# Altium project Service_eval_board.PrjPcb (part 2 of 3)

## Sheet MCU.SchDoc
size A3; DocumentNumber: 5; SheetNumber: 5; SheetTotal: 10
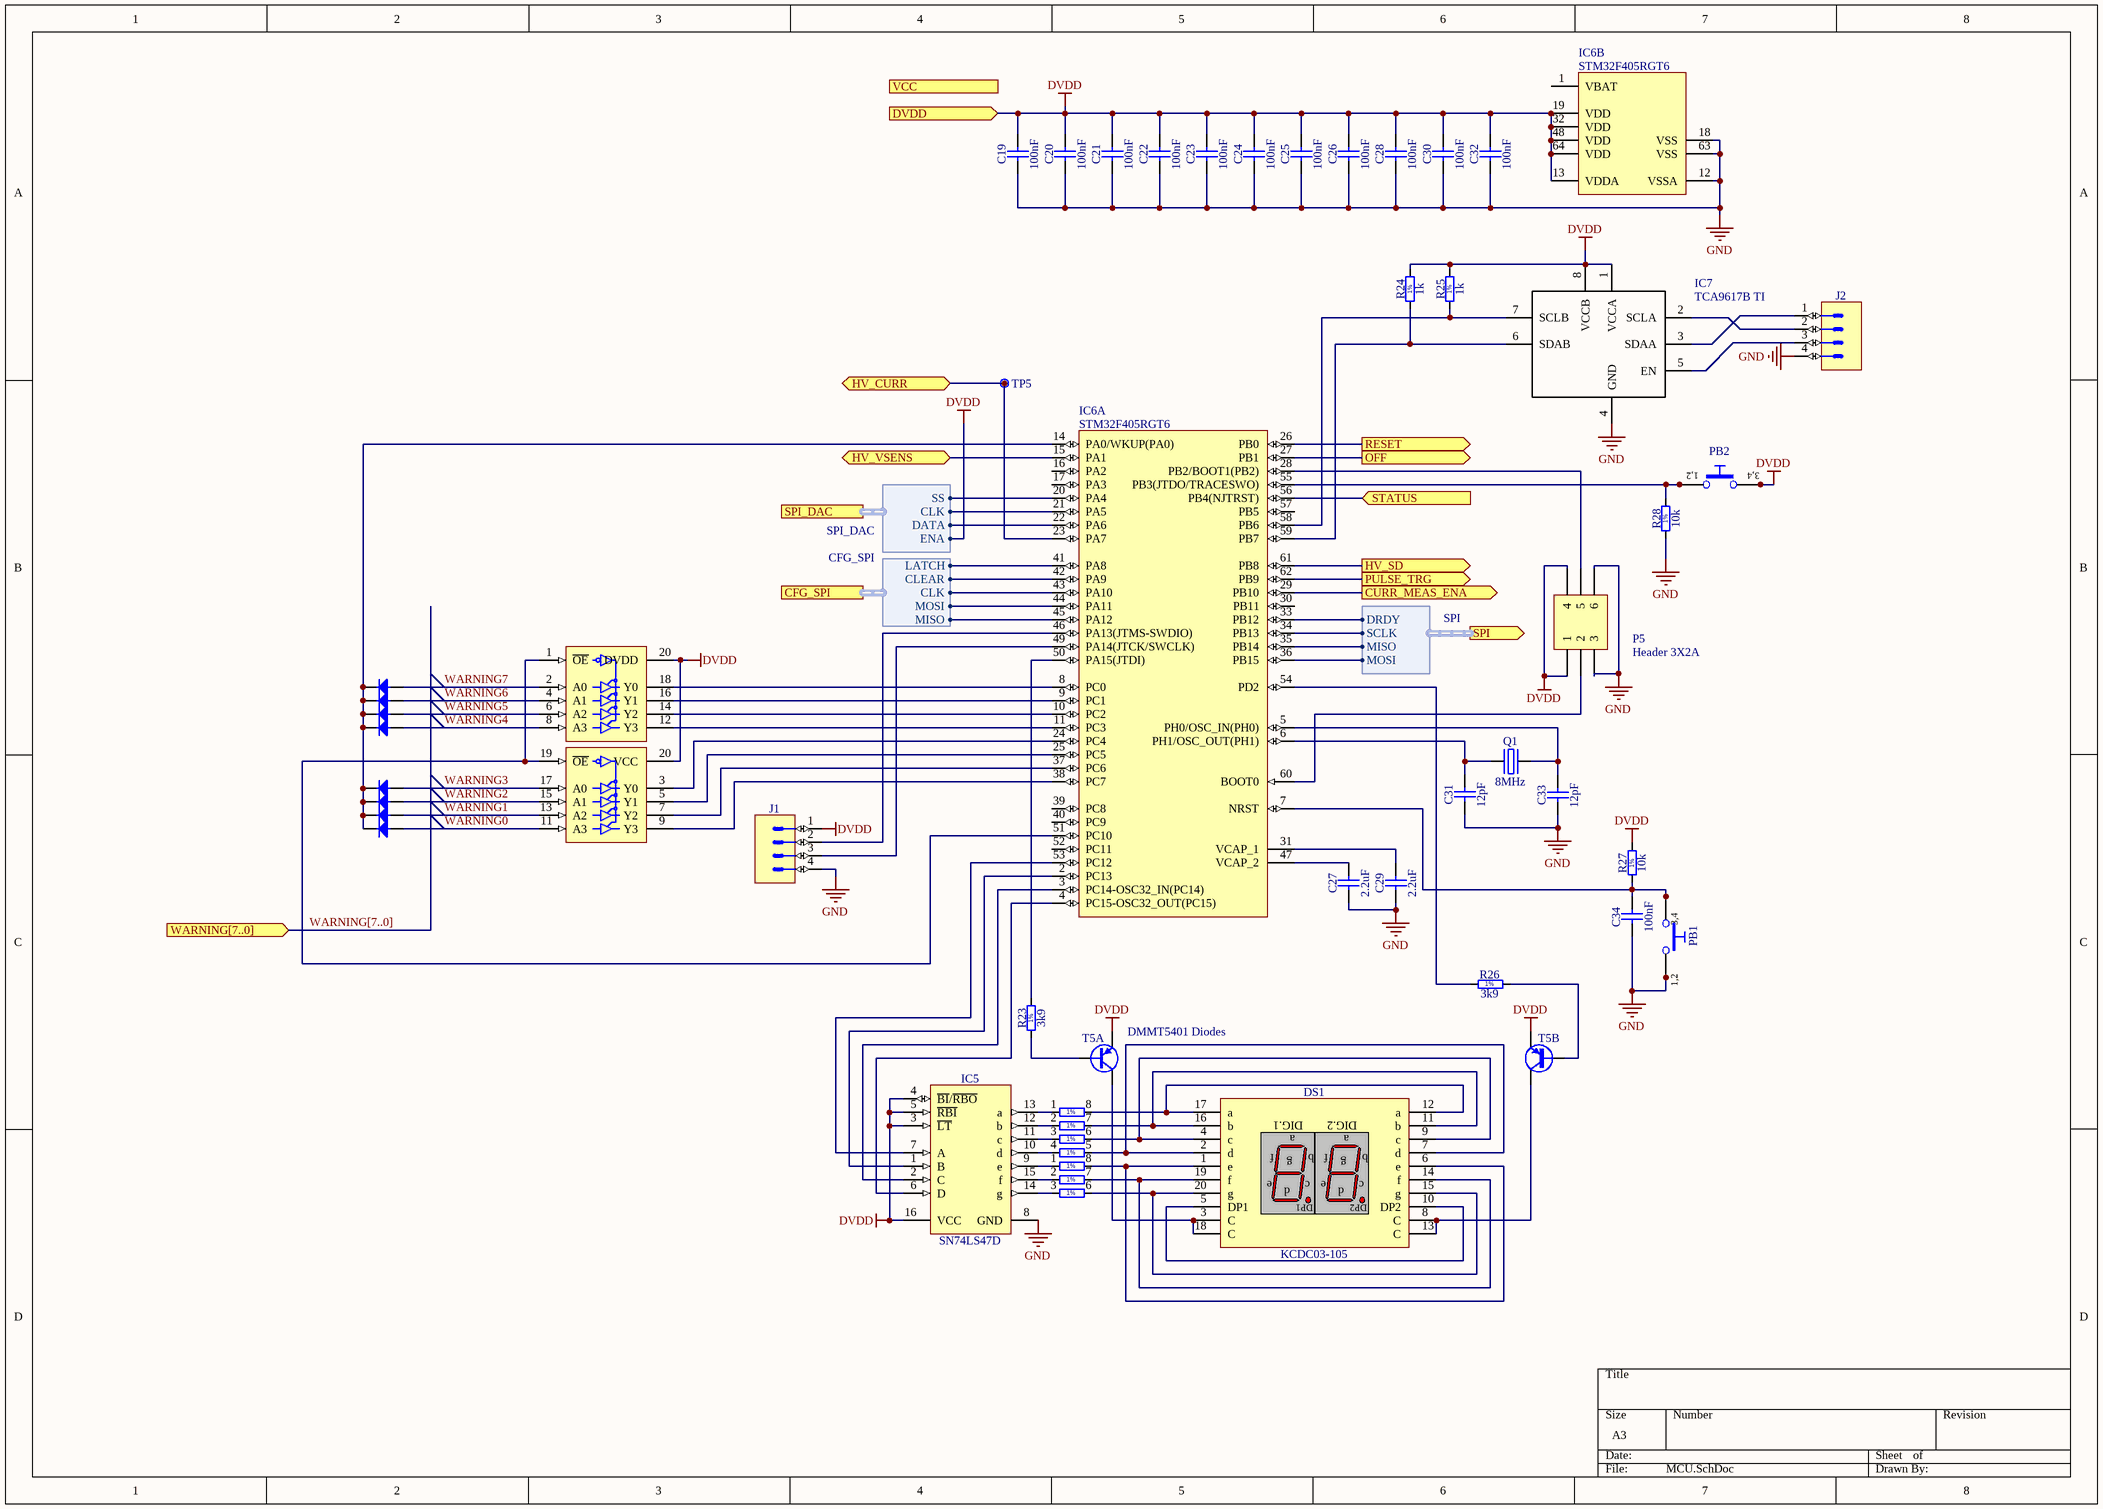
[diagram p3: MCU.SchDoc]

### Parts
C19  100nF  [CAPC2012X135N]
C20  100nF  [CAPC2012X135N]
C21  100nF  [CAPC2012X135N]
C22  100nF  [CAPC2012X135N]
C23  100nF  [CAPC2012X135N]
C24  100nF  [CAPC2012X135N]
C25  100nF  [CAPC2012X135N]
C26  100nF  [CAPC2012X135N]
C27  2.2uF  [CAPC2012X135N]
C28  100nF  [CAPC2012X135N]
C29  2.2uF  [CAPC2012X135N]
C30  100nF  [CAPC2012X135N]
C31  12pF  [CAPC2012X135N]
C32  100nF  [CAPC2012X135N]
C33  12pF  [CAPC2012X135N]
C34  100nF  [CAPC2012X135N]
D3  MCL4148-TR3  [DIOMELF1911N]  (value not drawn)
D4  MCL4148-TR3  [DIOMELF1911N]  (value not drawn)
D5  MCL4148-TR3  [DIOMELF1911N]  (value not drawn)
D6  MCL4148-TR3  [DIOMELF1911N]  (value not drawn)
D7  MCL4148-TR3  [DIOMELF1911N]  (value not drawn)
D8  MCL4148-TR3  [DIOMELF1911N]  (value not drawn)
D9  MCL4148-TR3  [DIOMELF1911N]  (value not drawn)
D10  MCL4148-TR3  [DIOMELF1911N]  (value not drawn)
DS1  KCDC03-105  [DS_KINGBRIGHT_KCDC03-105]
IC4  74HCT244D  [SOIC127P1032X265-20N]  (value not drawn)  (parts A,B of 2)
IC5  SN74LS47D  [SOIC127P600X175-16N]
IC6  STM32F405RGT6  [QFP50P1200X1200X160-64N]  (parts A,B of 2)
IC7  TCA9617B TI  [TSOP65P490X110-8N]
J1  Header 4  [PRECI-DIP_350-V3-104-00-001101]  (value not drawn)
J2  Header 4  [PRECI-DIP_350-V3-104-00-001101]  (value not drawn)
P5  Header 3X2A  [HDR2X3_CEN]
PB1  Push Button  [PB_OMRON_B3F-1000]  (value not drawn)
PB2  Push Button  [PB_OMRON_B3F-1000]  (value not drawn)
Q1  8MHz  [XTAL_TXC_7A]
R23  3k9  [RESC2012X60N]
R24  1k  [RESC2012X60N]
R25  1k  [RESC2012X60N]
R26  3k9  [RESC2012X60N]
R27  10k  [RESC2012X60N]
R28  10k  [RESC2012X60N]
RN1  220  [RN_VISHAY_CRA12E08]  (value not drawn)  (parts A,B,C,D of 4)
RN2  220  [RN_VISHAY_CRA12E08]  (value not drawn)  (parts A,B,C of 4)
T5  DMMT5401 Diodes  [SOT95P280X145-6N]  (parts A,B of 2)
TP5  Test Point  [VERO_20-2136]  (value not drawn)

### Ports
CFG_SPI (harness CFG_SPI), CURR_MEAS_ENA (out), DVDD (in), HV_CURR (bidir), HV_SD (out), HV_VSENS (bidir), OFF (out), PULSE_TRG (out), RESET (out), SPI (out, harness SPI), SPI_DAC (harness SPI_DAC), STATUS (in), VCC (in), WARNING[7..0] (in)

### Harnesses
SPI_DAC: SS, CLK, DATA, ENA
SPI: DRDY, MISO, SCLK, MOSI
CFG_SPI: LATCH, CLEAR, CLK, MOSI, MISO

### Nets
DVDD: C19.2 C20.2 C21.2 C22.2 C23.2 C24.2 C25.2 C26.2 C28.2 C30.2 C32.2 IC4.20(DVDD) IC5.3(~{LT}) IC5.4(~{BI}/~{RBO}) IC5.5(~{RBI}) IC5.16(VCC) IC6.13(VDDA) IC6.19(VDD) IC6.32(VDD) IC6.48(VDD) IC6.64(VDD) IC7.1(VCCA) IC7.8(VCCB) J1.1 P5.1 P5.4 PB2.3 PB2.4 R24.2 R25.2 R27.2 T5.5(E) T5.6(E) ; port DVDD, port SPI_DAC.ENA
GND: C19.1 C20.1 C21.1 C22.1 C23.1 C24.1 C25.1 C26.1 C27.1 C28.1 C29.1 C30.1 C31.1 C32.1 C33.1 C34.1 IC4.10(GND) IC5.8(GND) IC6.12(VSSA) IC6.18(VSS) IC6.63(VSS) IC7.4(GND) J1.4 J2.4 P5.3 P5.6 PB1.1 PB1.2 R28.1
WARNING0: D10.2(A) IC4.11(A3)  [project net W_B0]
WARNING1: D9.2(A) IC4.13(A2)  [project net W_B1]
WARNING2: D8.2(A) IC4.15(A1)  [project net W_B2]
WARNING3: D7.2(A) IC4.17(A0)  [project net W_B3]
WARNING4: D6.2(A) IC4.8(A3)  [project net W_A0]
WARNING5: D5.2(A) IC4.6(A2)  [project net W_A1]
WARNING6: D4.2(A) IC4.4(A1)  [project net W_A2]
WARNING7: D3.2(A) IC4.2(A0)  [project net W_A3]
NetC27_2: C27.2 IC6.47(VCAP_2)
NetC29_2: C29.2 IC6.31(VCAP_1)
NetC31_2: C31.2 IC6.6(PH1/OSC_OUT(PH1)) Q1.1(OSC1)
NetC33_2: C33.2 IC6.5(PH0/OSC_IN(PH0)) Q1.2(OSC2)
NetC34_2: C34.2 IC6.7(NRST) PB1.3 PB1.4 R27.1
NetD3_1: D3.1(C) D4.1(C) D5.1(C) D6.1(C) D7.1(C) D8.1(C) D9.1(C) D10.1(C) IC6.14(PA0/WKUP(PA0))
NetD12_1: IC6.15(PA1) ; port HV_VSENS
NetDS1_1: DS1.1(e) DS1.6(e) RN2.8
NetDS1_2: DS1.2(d) DS1.7(d) RN1.5
NetDS1_3: DS1.3(C) DS1.18(C) T5.1(C)
NetDS1_4: DS1.4(c) DS1.9(c) RN1.6
NetDS1_5: DS1.5(DP1) DS1.10(DP2)
NetDS1_8: DS1.8(C) DS1.13(C) T5.4(C)
NetDS1_11: DS1.11(b) DS1.16(b) RN1.7
NetDS1_12: DS1.12(a) DS1.17(a) RN1.8
NetDS1_14: DS1.14(f) DS1.19(f) RN2.7
NetDS1_15: DS1.15(g) DS1.20(g) RN2.6
NetIC1_9: IC6.45(PA12) ; port CFG_SPI.MISO
NetIC1_10: IC6.42(PA9) ; port CFG_SPI.CLEAR
NetIC1_11: IC6.43(PA10) ; port CFG_SPI.CLK
NetIC1_12: IC6.41(PA8) ; port CFG_SPI.LATCH
NetIC1_14: IC6.44(PA11) ; port CFG_SPI.MOSI
NetIC2_1_2: IC6.27(PB1) ; port OFF
NetIC2_1_4: IC6.26(PB0) ; port RESET
NetIC2_1_6: IC6.29(PB10) ; port CURR_MEAS_ENA
NetIC4_1: IC4.1(~{OE}) IC4.19(~{OE}) IC6.51(PC10)
NetIC4_3: IC4.3(Y0) IC6.24(PC4)
NetIC4_5: IC4.5(Y1) IC6.25(PC5)
NetIC4_7: IC4.7(Y2) IC6.37(PC6)
NetIC4_9: IC4.9(Y3) IC6.38(PC7)
NetIC4_12: IC4.12(Y3) IC6.11(PC3)
NetIC4_14: IC4.14(Y2) IC6.10(PC2)
NetIC4_16: IC4.16(Y1) IC6.9(PC1)
NetIC4_18: IC4.18(Y0) IC6.8(PC0)
NetIC5_1: IC5.1(B) IC6.2(PC13)
NetIC5_2: IC5.2(C) IC6.3(PC14-OSC32_IN(PC14))
NetIC5_6: IC5.6(D) IC6.4(PC15-OSC32_OUT(PC15))
NetIC5_7: IC5.7(A) IC6.53(PC12)
NetIC5_9: IC5.9(e) RN2.1
NetIC5_10: IC5.10(d) RN1.4
NetIC5_11: IC5.11(c) RN1.3
NetIC5_12: IC5.12(b) RN1.2
NetIC5_13: IC5.13(a) RN1.1
NetIC5_14: IC5.14(g) RN2.3
NetIC5_15: IC5.15(f) RN2.2
NetIC6_20: IC6.20(PA4) ; port SPI_DAC.SS
NetIC6_21: IC6.21(PA5) ; port SPI_DAC.CLK
NetIC6_22: IC6.22(PA6) ; port SPI_DAC.DATA
NetIC6_23: IC6.23(PA7) TP5.1 ; port HV_CURR
NetIC6_28: IC6.28(PB2/BOOT1(PB2)) P5.5
NetIC6_33: IC6.33(PB12) ; port SPI.DRDY
NetIC6_34: IC6.34(PB13) ; port SPI.SCLK
NetIC6_35: IC6.35(PB14) ; port SPI.MISO
NetIC6_36: IC6.36(PB15) ; port SPI.MOSI
NetIC6_46: IC6.46(PA13(JTMS-SWDIO)) J1.2
NetIC6_49: IC6.49(PA14(JTCK/SWCLK)) J1.3
NetIC6_50: IC6.50(PA15(JTDI)) R23.2
NetIC6_54: IC6.54(PD2) R26.1
NetIC6_55: IC6.55(PB3(JTDO/TRACESWO)) PB2.1 PB2.2 R28.2
NetIC6_56: IC6.56(PB4(NJTRST)) ; port STATUS
NetIC6_58: IC6.58(PB6) IC7.7(SCLB) R25.1
NetIC6_59: IC6.59(PB7) IC7.6(SDAB) R24.1
NetIC6_60: IC6.60(BOOT0) P5.2
NetIC6_61: IC6.61(PB8) ; port HV_SD
NetIC6_62: IC6.62(PB9) ; port PULSE_TRG
NetIC7_2: IC7.2(SCLA) J2.2
NetIC7_3: IC7.3(SDAA) J2.1
NetIC7_5: IC7.5(EN) J2.3
NetR23_1: R23.1 T5.2(B)
NetR26_2: R26.2 T5.3(B)

Not connected (* = marked no-connect by the designer): IC6 1(VBAT) 16(PA2) 17(PA3) 30(PB11) 39(PC8) 40(PC9) 52(PC11) 57(PB5)

### Buses and harness runs
bus WARNING[7..0] = port WARNING[7..0]

### Notes on the sheet
- (in symbol DS_KINGBRIGHT_KCDC03-105) DIG.1; DIG.2
- (in symbol PB_OMRON_B3F-1000) 3,4; 1,2
- (in symbol R0805_1K_1%_0.125W_100PPM) 1%
- (in symbol R0805_3K9_1%_0.125W_100PPM) 1%
- (in symbol R0805_10K_1%_0.125W_100PPM) 1%
- (in symbol RN_220R_VISHAY_CRA12E083220RF, part A) 1%
- (in symbol RN_220R_VISHAY_CRA12E083220RF, part B) 1%
- (in symbol RN_220R_VISHAY_CRA12E083220RF, part C) 1%
- (in symbol RN_220R_VISHAY_CRA12E083220RF, part D) 1%

### Library data of the parts
C19-C26 C28 C30 C32 C34 = CC0805_100NF_50V_10%_X7R: as C35 on sheet Pulser; Part Number: CC0805_100NF_50V_10%_X7R; Component Kind: Standard; Component Type: Standard; Pin Count: 2; Value: 100nF; Status: Preferred; Manufacturer Part Number: CC0805_100NF_50V_10%_X7R; Case: 0805; Mounted: Yes; Socket: No; SMD: Yes; Sense: No; Manufacturer1 Example: TDK; Manufacturer1 ComponentHeight: 1mm; HelpURL: \\cern.ch\dfs\Applications\Altium\Datasheets\CC0805_X7R_TDK_C.pdf; Author: CERN DEM JLC; CreateDate: 03.12.2007; LatestRevisionDate: 22.04.2015
C27 C29 = CC0805_2.2UF_16V_10%_X7R: Non-polarised capacitor; Part Description: SMD Multilayer Chip Ceramic Capacitor; Manufacturer: GENERIC; Manufacturer1 Part Number: GRM21BF51C225ZA01L; Voltage: 16V; TC: X7R; Tolerance: ±10%; Part Number: CC0805_2.2UF_16V_10%_X7R; Component Kind: Standard; Component Type: Standard; Pin Count: 2; Value: 2.2uF; Status: Preferred; Manufacturer Part Number: CC0805_2.2UF_16V_10%_X7R; Case: 0805; Mounted: Yes; Socket: No; SMD: Yes; Sense: No; Manufacturer1 Example: MURATA; Manufacturer1 ComponentHeight: 1.5mm; HelpURL: \\cern.ch\dfs\Applications\Altium\Datasheets\CC0805_X7R_MURATA_GRM.pdf; Author: CERN DEM JLC; CreateDate: 03.12.2007; LatestRevisionDate: 18.09.2014
C31 C33 = CC0805_12PF_50V_5%_NP0: Non-polarised capacitor; Part Description: SMD Multilayer Chip Ceramic Capacitor; Manufacturer: GENERIC; Manufacturer1 Part Number: 223886115129; Voltage: 50V; TC: C0G/NP0; Tolerance: ±5%; Part Number: CC0805_12PF_50V_5%_NP0; Component Kind: Standard; Component Type: Standard; Pin Count: 2; Value: 12pF; Status: Preferred; Manufacturer Part Number: CC0805_12PF_50V_5%_NP0; Case: 0805; Mounted: Yes; Socket: No; SMD: Yes; Sense: No; Manufacturer1 Example: PHYCOMP; Manufacturer1 ComponentHeight: 1.35mm; HelpURL: \\cern.ch\dfs\Applications\Altium\Datasheets\CC0805_NP0_PHYCOMP.pdf; Author: CERN DEM JLC; CreateDate: 03.12.2007; LatestRevisionDate: 03.12.2007
D3-D10 = MCL4148-TR3: Diode; Part Description: Small Signal Fast Switching Diode; Manufacturer: VISHAY GENERAL SEMICONDUCTOR; Voltage: 75V; Power: 200mA; PressFit: No; Bonding: No; Part Number: MCL4148-TR3; Component Kind: Standard; Component Type: Standard; Device: MCL4148-TR3; PackageDescription: MELF Diode, 2-Leads, Body 1.7x1.15mm, IPC Medium Density; Status: Not recommended; Manufacturer Part Number: MCL4148-TR3; Pin Count: 2; Mounted: Yes; Socket: No; SMD: Yes; Sense: No; ComponentHeight: 1.35mm; HelpURL: \\cern.ch\dfs\Applications\Altium\Datasheets\MCL4148-TR3.pdf; Author: CERN DEM JLC; CreateDate: 10.11.2014; LatestRevisionDate: 10.11.2014
DS1 = DS_KINGBRIGHT_KCDC03-105: Dual Digit, SMD 7-Segment Common Cathode Hyper Red Display; PressFit: No; Bonding: No; Part Number: DS_KINGBRIGHT_KCDC03-105; Component Kind: Standard; Component Type: Standard; Color: Hyper Red; Device: KCDC03-105; PackageDescription: 20-Leads, Body 14.8x12mm, Pitch 1.5mm, Hyper Red SMD Common Cathode Dual 7-SegmentDisplay; Part Description: Dual Digit, SMD 7-Segment Common Cathode Hyper Red Display; Manufacturer: KINGBRIGHT; Manufacturer Part Number: KCDC03-105; Pin Count: 20; Mounted: Yes; Socket: No; SMD: Yes; Sense: No; ComponentHeight: 3.75mm; HelpURL: \\cern.ch\dfs\Applications\Altium\Datasheets\DS_KINGBRIGHT_KCDC03-105.pdf; Author: CERN DEM JLC; CreateDate: 12.05.2014; LatestRevisionDate: 21.10.2016
IC4 = 74HCT244D: Octal Buffer And Line Driver with 3-State Ouputs; Part Description: Octal Buffer/Line Driver with 3-State Outputs; Manufacturer: NXP SEMICONDUCTORS; PressFit: No; Bonding: No; Part Number: 74HCT244D; Component Kind: Standard; Component Type: Standard; Device: 74HCT244D; PackageDescription: SOIC, 1.27mm pitch; 20 pin, 7.50mm W X 12.80mm L X 2.65mm H body, IPC Medium Density; Manufacturer Part Number: 74HCT244D; Pin Count: 20; Case: SOIC20; Mounted: Yes; Socket: No; SMD: Yes; Sense: No; ComponentHeight: 2.65mm; Author: CERN DEM JLC; HelpURL: \\cern.ch\dfs\Applications\Altium\Datasheets\74HCT244D.pdf; CreateDate: 27.08.2013; LatestRevisionDate: 27.08.2013
IC5 = SN74LS47D: BCD-to-Seven-Segment Decoder/Driver; Manufacturer: TEXAS INSTRUMENTS; PressFit: No; Bonding: No; Part Number: SN74LS47D; Component Kind: Standard; Component Type: Standard; Device: SN74LS47D; PackageDescription: SOIC 16, Pitch 1.27mm - Body 4x10mm, IPC Medium Density; Part Description: BCD-to-Seven-Segment Decoder/Driver; Manufacturer Part Number: SN74LS47D; Pin Count: 16; Case: SOIC16; Mounted: Yes; Socket: No; SMD: Yes; Sense: No; ComponentHeight: 1.75mm; Author: CERN DEM JMW; HelpURL: \\cern.ch\dfs\Applications\Altium\Datasheets\SN74LS47D.pdf; CreateDate: 04.10.2012; LatestRevisionDate: 04.10.2012
IC6 = STM32F405RGT6: ARM Cortex-M4 32-bit MCU+FPU, 210DMIPS, 1024kB Flash, 192kB+4kB RAM, 51 I/Os, 64-pin LQFP, Industrial Grade –40 to 85°C; Manufacturer: ST MICROELECTRONICS; PressFit: No; Bonding: No; Part Number: STM32F405RGT6; Component Kind: Standard; Component Type: Standard; Device: STM32F405RGT6; PackageDescription: QFP, 0.50mm pitch, square; 16 pin X 16 pin, 10.00mm X 10.00mm, 1.6mm H, IPC Medium Density; Part Description: ARM Cortex-M4 32-bit MCU+FPU, 210DMIPS, 1024kB Flash, 192kB+4kB RAM, 51 I/Os, 64-pin LQFP, Industrial Grade –40 to 85°C; Manufacturer Part Number: STM32F405RGT6; Pin Count: 64; Case: QFP64; Mounted: Yes; Socket: No; SMD: Yes; Sense: No; ComponentHeight: 1.6mm; HelpURL: \\cern.ch\dfs\Applications\Altium\Datasheets\STM32F405RGT6.pdf; Author: CERN DEM JLC; CreateDate: 20.06.2017; LatestRevisionDate: 20.06.2017
IC7 = TCA9617B: Name: TCA9617B; Manufacturer: TI
J1 J2 = PRECI-DIP_350-V3-104-00-001101: Connector 4 Male; Part Description: Pitch 2.54mm, Single Row, Straight 4 Contacts PCB Header; PressFit: No; Part Number: PRECI-DIP_350-V3-104-00-001101; Component Kind: Standard; Component Type: Standard; Pin Count: 4; Family: Header 4; Mounted: Yes; Socket: No; SMD: No; Sense: No; Status: None; Manufacturer: PRECI-DIP; Manufacturer Part Number: 350-V3-104-00-001101; ComponentHeight: 7.96mm; HelpURL: \\cern.ch\dfs\Applications\Altium\Datasheets\PRECI-DIP_350-V3-104-00-001101.pdf; Author: CERN DEM BC; CreateDate: 18.03.2016; LatestRevisionDate: 18.03.2016
P5 = Header 3X2A: Header, 3-Pin, Dual row; LatestRevisionDate: 17-Jul-2002; LatestRevisionNote: Re-released for DXP Platform.; Publisher: Altium Limited
PB1 PB2 = PB_OMRON_B3F-1000: Push-Button Switch SPDT; Part Description: 24VDC 50mA SPST-NO Tactile Push-Button Switch (h=4.5mm); Manufacturer: OMRON; PressFit: No; Part Number: PB_OMRON_B3F-1000; Component Kind: Standard; Component Type: Standard; Pin Count: 4; PackageDescription: 6x6mm Model, Horizontal, Flat Plunger Type (without Ground Terminal) Pushbutton Switch, OMRON B3F Series; Family: Push Button; Mounted: Yes; Socket: No; SMD: No; Sense: No; Status: None; Manufacturer Part Number: B3F-1000; ComponentHeight: 4.5mm; HelpURL: \\cern.ch\dfs\Applications\Altium\Datasheets\PB_OMRON_B3F-1000.pdf; Author: CERN DEM JMW; CreateDate: 23.10.2008; LatestRevisionDate: 06.05.2009
Q1 = XTAL_8MHZ_TXC_7A-8.000MAAE-T: Quartz Crystal; Part Description: Tolerance: ±30ppm, Stability: ±30ppm, -20°C to +70°C, 12pF, SMD Glass Seam Sealing Crystal, 7A Series; Manufacturer: TXC CORPORATION; PressFit: No; Bonding: No; Part Number: XTAL_8MHZ_TXC_7A-8.000MAAE-T; Component Kind: Standard; Component Type: Standard; PackageDescription: 2 Pins, 3.2x5mm, SMD Glass Seam Sealing Crystal, 7A Serie; Value: 8MHz; Manufacturer Part Number: 7A-8.000MAAE-T; Pin Count: 2; Mounted: Yes; Socket: No; SMD: Yes; Sense: No; ComponentHeight: 1.2mm; HelpURL: \\cern.ch\dfs\Applications\Altium\Datasheets\XTAL_TXC_7A.pdf; Author: CERN DEM JLC; CreateDate: 09.10.2014; LatestRevisionDate: 12.11.2014
R23 R26 = R0805_3K9_1%_0.125W_100PPM: Resistor - 1%; Part Description: General Purpose Thick Film Chip Resistor; Manufacturer: GENERIC; Manufacturer1 Part Number: NRC10F3901TRF; Power: 0.125W; TC: ±100ppm/°C; PressFit: No; Part Number: R0805_3K9_1%_0.125W_100PPM; Component Kind: Standard; Component Type: Standard; Pin Count: 2; Value: 3k9; Status: Preferred; Tolerance: ±1%; Manufacturer Part Number: R0805_3K9_1%_0.125W_100PPM; Case: 0805; Mounted: Yes; Sense: No; Socket: No; SMD: Yes; Manufacturer1 Example: NIC COMPONENT; Manufacturer1 ComponentHeight: 0.6mm; HelpURL: \\cern.ch\dfs\Applications\Altium\Datasheets\R0805_NIC_NRC.pdf; Author: CERN DEM JLC; CreateDate: 03.12.2007; LatestRevisionDate: 13.03.2008
R24 R25 = R0805_1K_1%_0.125W_100PPM: Resistor - 1%; Part Description: General Purpose Thick Film Chip Resistor; Manufacturer: GENERIC; Manufacturer1 Part Number: NRC10F1001TRF; Power: 0.125W; TC: ±100ppm/°C; PressFit: No; Part Number: R0805_1K_1%_0.125W_100PPM; Component Kind: Standard; Component Type: Standard; Pin Count: 2; Value: 1k; Status: Preferred; Tolerance: ±1%; Manufacturer Part Number: R0805_1K_1%_0.125W_100PPM; Case: 0805; Mounted: Yes; Sense: No; Socket: No; SMD: Yes; Manufacturer1 Example: NIC COMPONENT; Manufacturer1 ComponentHeight: 0.6mm; HelpURL: \\cern.ch\dfs\Applications\Altium\Datasheets\R0805_NIC_NRC.pdf; Author: CERN DEM JLC; CreateDate: 03.12.2007; LatestRevisionDate: 13.03.2008
R27 R28 = R0805_10K_1%_0.125W_100PPM: Resistor - 1%; Part Description: General Purpose Thick Film Chip Resistor; Manufacturer: GENERIC; Manufacturer1 Part Number: NRC10F1002TRF; Power: 0.125W; TC: ±100ppm/°C; PressFit: No; Part Number: R0805_10K_1%_0.125W_100PPM; Component Kind: Standard; Component Type: Standard; Pin Count: 2; Value: 10k; Status: Preferred; Tolerance: ±1%; Manufacturer Part Number: R0805_10K_1%_0.125W_100PPM; Case: 0805; Mounted: Yes; Sense: No; Socket: No; SMD: Yes; Manufacturer1 Example: NIC COMPONENT; Manufacturer1 ComponentHeight: 0.6mm; HelpURL: \\cern.ch\dfs\Applications\Altium\Datasheets\R0805_NIC_NRC.pdf; Author: CERN DEM JLC; CreateDate: 03.12.2007; LatestRevisionDate: 13.03.2008
RN1 RN2 = RN_220R_VISHAY_CRA12E083220RF: DIL8 Resistor Network 4 Isolated Resistor 1%; Part Description: Chip Resistor Array , 4 Isolated Resistors (Convex Terminal), CRA12E Series; Manufacturer: VISHAY; Power: 0.125W; TC: ±200ppm/°C; PressFit: No; Part Number: RN_220R_VISHAY_CRA12E083220RF; Component Kind: Standard; Component Type: Standard; Pin Count: 8; Value: 220; Sense: No; Tolerance: ±1%; Manufacturer Part Number: CRA12E083220RF; Mounted: Yes; Socket: No; SMD: Yes; ComponentHeight: 0.7mm; HelpURL: \\cern.ch\dfs\Applications\Altium\Datasheets\RN_VISHAY_CRA12E.pdf; Author: CERN DEM BC; CreateDate: 25.08.2015; LatestRevisionDate: 03.05.2017
T5 = DMMT5401: Name: DMMT5401; Manufacturer: Diodes
TP5 = VERO_20-2136: Part Description: Black Bead PCB Terminal Test Pin for 1.6mm PCB Thickness (1.32mm Hole); Manufacturer: VERO TECHNOLOGIES; PressFit: No; Part Number: VERO_20-2136; Component Kind: Standard; Component Type: Standard; Pin Count: 1; Family: Test Point; Mounted: Yes; Socket: No; SMD: No; Sense: No; Status: None; Manufacturer Part Number: 20-2136; ComponentHeight: 5.3mm; HelpURL: \\cern.ch\dfs\Applications\Altium\Datasheets\VERO_20-2136.pdf; Author: CERN DEM JLC; CreateDate: 21.07.2008; LatestRevisionDate: 15.07.2013

## Sheet Bank.SchDoc
size A4; DocumentNumber: 2; SheetNumber: 2; SheetTotal: 10
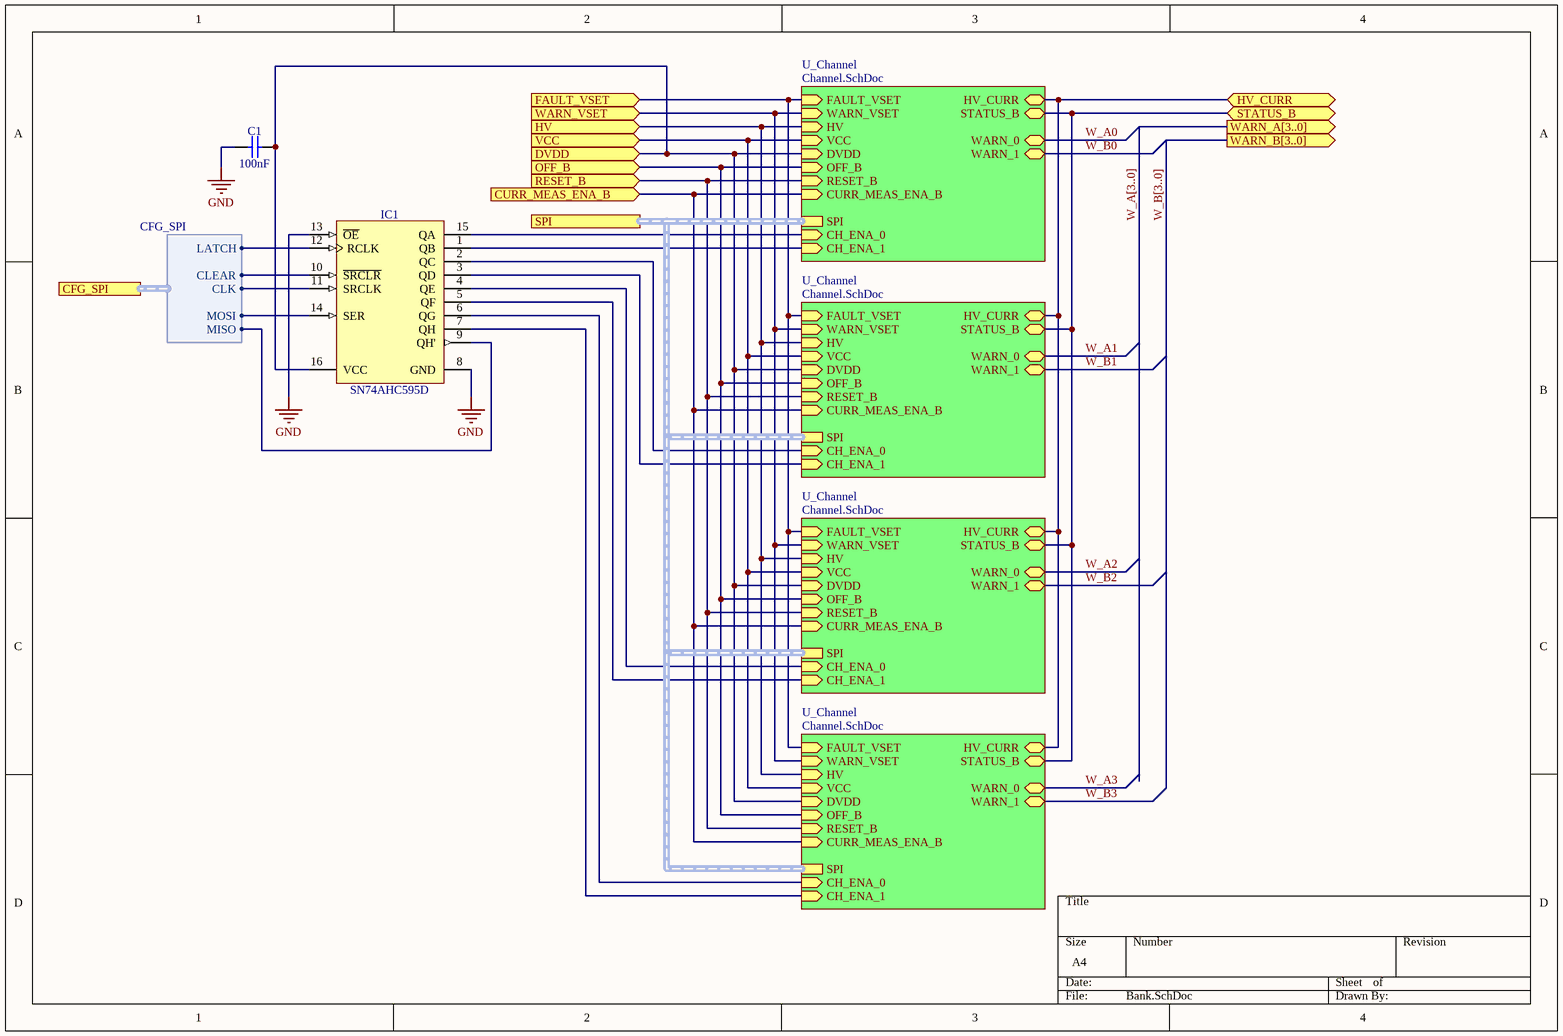
[diagram p4: Bank.SchDoc]

### Parts
C1  100nF  [CAPC2012X135N]
IC1  SN74AHC595D  [SOIC127P600X175-16N]

### Sub-sheets
U_Channel = Channel.SchDoc: FAULT_VSET (in), WARN_VSET (in), HV (in), DVDD (in), OFF_B (in), RESET_B (in), CURR_MEAS_ENA_B (in), CH_ENA_0 (in), SPI (harness SPI), CH_ENA_1 (in), WARN_0 (bidir), HV_CURR (bidir), VCC (in), STATUS_B (bidir), WARN_1 (bidir)
U_Channel = Channel.SchDoc: FAULT_VSET (in), WARN_VSET (in), HV (in), DVDD (in), OFF_B (in), RESET_B (in), CURR_MEAS_ENA_B (in), CH_ENA_0 (in), SPI (harness SPI), CH_ENA_1 (in), WARN_0 (bidir), HV_CURR (bidir), VCC (in), STATUS_B (bidir), WARN_1 (bidir)
U_Channel = Channel.SchDoc: FAULT_VSET (in), WARN_VSET (in), HV (in), DVDD (in), OFF_B (in), RESET_B (in), CURR_MEAS_ENA_B (in), CH_ENA_0 (in), SPI (harness SPI), CH_ENA_1 (in), WARN_0 (bidir), HV_CURR (bidir), VCC (in), STATUS_B (bidir), WARN_1 (bidir)
U_Channel = Channel.SchDoc: FAULT_VSET (in), WARN_VSET (in), HV (in), DVDD (in), OFF_B (in), RESET_B (in), CURR_MEAS_ENA_B (in), CH_ENA_0 (in), SPI (harness SPI), CH_ENA_1 (in), WARN_0 (bidir), HV_CURR (bidir), VCC (in), STATUS_B (bidir), WARN_1 (bidir)

### Ports
CFG_SPI (harness CFG_SPI), CURR_MEAS_ENA_B (in), DVDD (in), FAULT_VSET (in), HV (in), HV_CURR (bidir), OFF_B (in), RESET_B (in), SPI (harness SPI), STATUS_B (bidir), VCC (in), WARN_A[3..0] (out), WARN_B[3..0] (out), WARN_VSET (in)

### Harnesses
CFG_SPI: LATCH, CLK, MOSI, MISO, CLEAR

### Nets
DVDD: C1.2 IC1.16(VCC) ; port DVDD, sheet U_Channel/DVDD, sheet U_Channel/DVDD, sheet U_Channel/DVDD, sheet U_Channel/DVDD
GND: C1.1 IC1.8(GND) IC1.13(~{OE})
NetC15_2: port HV, sheet U_Channel/HV, sheet U_Channel/HV, sheet U_Channel/HV, sheet U_Channel/HV
NetC45_1_1: port VCC, sheet U_Channel/VCC, sheet U_Channel/VCC, sheet U_Channel/VCC, sheet U_Channel/VCC
NetIC1_1: IC1.1(QB) ; sheet U_Channel/CH_ENA_1
NetIC1_2: IC1.2(QC) ; sheet U_Channel/CH_ENA_0
NetIC1_3: IC1.3(QD) ; sheet U_Channel/CH_ENA_1
NetIC1_4: IC1.4(QE) ; sheet U_Channel/CH_ENA_0
NetIC1_5: IC1.5(QF) ; sheet U_Channel/CH_ENA_1
NetIC1_6: IC1.6(QG) ; sheet U_Channel/CH_ENA_0
NetIC1_7: IC1.7(QH) ; sheet U_Channel/CH_ENA_1
NetIC1_9: IC1.9(QH') ; port CFG_SPI.MISO
NetIC1_10: IC1.10(~{SRCLR}) ; port CFG_SPI.CLEAR
NetIC1_11: IC1.11(SRCLK) ; port CFG_SPI.CLK
NetIC1_12: IC1.12(RCLK) ; port CFG_SPI.LATCH
NetIC1_14: IC1.14(SER) ; port CFG_SPI.MOSI
NetIC1_15: IC1.15(QA) ; sheet U_Channel/CH_ENA_0
NetIC2_1_2: port OFF_B, sheet U_Channel/OFF_B, sheet U_Channel/OFF_B, sheet U_Channel/OFF_B, sheet U_Channel/OFF_B
NetIC2_1_4: port RESET_B, sheet U_Channel/RESET_B, sheet U_Channel/RESET_B, sheet U_Channel/RESET_B, sheet U_Channel/RESET_B
NetIC2_1_6: port CURR_MEAS_ENA_B, sheet U_Channel/CURR_MEAS_ENA_B, sheet U_Channel/CURR_MEAS_ENA_B, sheet U_Channel/CURR_MEAS_ENA_B, sheet U_Channel/CURR_MEAS_ENA_B
NetIC6_23: port HV_CURR, sheet U_Channel/HV_CURR, sheet U_Channel/HV_CURR, sheet U_Channel/HV_CURR, sheet U_Channel/HV_CURR
NetIC6_56: port STATUS_B, sheet U_Channel/STATUS_B, sheet U_Channel/STATUS_B, sheet U_Channel/STATUS_B, sheet U_Channel/STATUS_B
NetR40_1_1: port FAULT_VSET, sheet U_Channel/FAULT_VSET, sheet U_Channel/FAULT_VSET, sheet U_Channel/FAULT_VSET, sheet U_Channel/FAULT_VSET
NetR41_1_1: port WARN_VSET, sheet U_Channel/WARN_VSET, sheet U_Channel/WARN_VSET, sheet U_Channel/WARN_VSET, sheet U_Channel/WARN_VSET

### Buses and harness runs
bus W_A[3..0] = port WARN_A[3..0]
bus W_B[3..0] = port WARN_B[3..0]
harness port SPI = sheet U_Channel/SPI

### Library data of the parts
C1 = CC0805_100NF_50V_10%_X7R: as C35 on sheet Pulser; Part Number: CC0805_100NF_50V_10%_X7R; Component Kind: Standard; Component Type: Standard; Pin Count: 2; Value: 100nF; Status: Preferred; Manufacturer Part Number: CC0805_100NF_50V_10%_X7R; Case: 0805; Mounted: Yes; Socket: No; SMD: Yes; Sense: No; Manufacturer1 Example: TDK; Manufacturer1 ComponentHeight: 1mm; HelpURL: \\cern.ch\dfs\Applications\Altium\Datasheets\CC0805_X7R_TDK_C.pdf; Author: CERN DEM JLC; CreateDate: 03.12.2007; LatestRevisionDate: 22.04.2015
IC1 = SN74AHC595D: 8-Bit Shift Register With 3-State Output Register; Part Description: 8-Bit Shift Register With 3-State Output Registers; Manufacturer: TEXAS INSTRUMENTS; PressFit: No; Bonding: No; Part Number: SN74AHC595D; Component Kind: Standard; Component Type: Standard; Device: SN74AHC595D; PackageDescription: SOIC 16, Pitch 1.27mm - Body 4x10mm, IPC Medium Density; Manufacturer Part Number: SN74AHC595D; Pin Count: 16; Case: SOIC16; Mounted: Yes; Socket: No; SMD: Yes; Sense: No; ComponentHeight: 1.75mm; Author: CERN DEM JLC; HelpURL: \\cern.ch\dfs\Applications\Altium\Datasheets\SN74AHC595D.pdf; CreateDate: 26.09.2013; LatestRevisionDate: 26.09.2013

## Sheet Channel.SchDoc
size A4; DocumentNumber: 3; SheetNumber: 3; SheetTotal: 10
Used 4 times, as channels U_Bank/U_Channel, U_Bank/U_Channel, U_Bank/U_Channel, U_Bank/U_Channel. Parts and nets are listed once, with the designators drawn on the sheet.
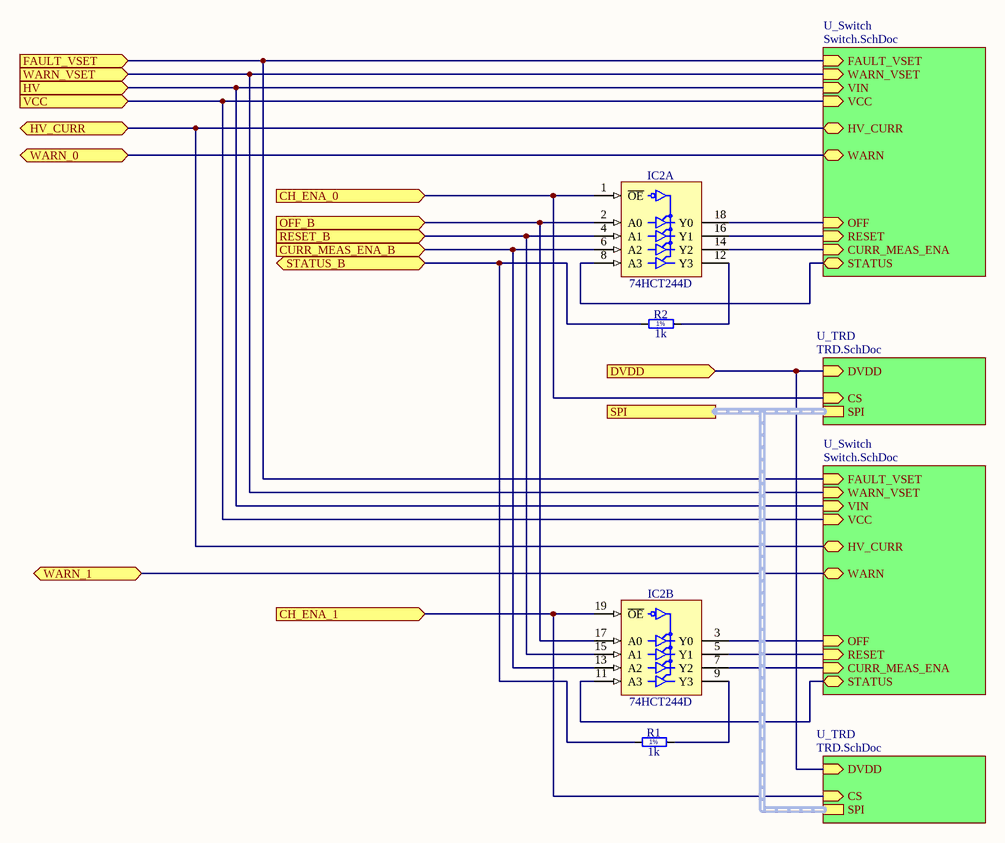
[diagram p5: Channel.SchDoc]

### Parts
IC2  74HCT244D  [SOIC127P1032X265-20N]  (parts A,B of 2)
R1  1k  [RESC2012X60N]
R2  1k  [RESC2012X60N]

### Sub-sheets
U_Switch = Switch.SchDoc: FAULT_VSET (in), WARN_VSET (in), RESET (in), VIN (in), OFF (in), HV_CURR (bidir), CURR_MEAS_ENA (in), VCC (in), WARN (bidir), STATUS (bidir)
U_Switch = Switch.SchDoc: FAULT_VSET (in), WARN_VSET (in), RESET (in), VIN (in), OFF (in), HV_CURR (bidir), CURR_MEAS_ENA (in), VCC (in), WARN (bidir), STATUS (bidir)
U_TRD = TRD.SchDoc: DVDD (in), SPI (harness SPI), CS (in)
U_TRD = TRD.SchDoc: DVDD (in), SPI (harness SPI), CS (in)

### Ports
CH_ENA_0 (in), CH_ENA_1 (in), CURR_MEAS_ENA_B (in), DVDD (in), FAULT_VSET (in), HV (in), HV_CURR (bidir), OFF_B (in), RESET_B (in), SPI (harness SPI), STATUS_B (bidir), VCC (in), WARN_0 (bidir), WARN_1 (bidir), WARN_VSET (in)

### Nets
GND: IC2.10(GND)
VCC: IC2.20(VCC)
CH_ENA_0: IC2.1(~{OE}) ; port CH_ENA_0, sheet U_TRD/CS
CH_ENA_1: IC2.19(~{OE}) ; port CH_ENA_1, sheet U_TRD/CS
CURR_MEAS_ENA_B: IC2.6(A2) IC2.13(A2) ; port CURR_MEAS_ENA_B
DVDD: port DVDD, sheet U_TRD/DVDD, sheet U_TRD/DVDD
FAULT_VSET: port FAULT_VSET, sheet U_Switch/FAULT_VSET, sheet U_Switch/FAULT_VSET
HV: port HV, sheet U_Switch/VIN, sheet U_Switch/VIN
HV_CURR: port HV_CURR, sheet U_Switch/HV_CURR, sheet U_Switch/HV_CURR
OFF_B: IC2.2(A0) IC2.17(A0) ; port OFF_B
RESET_B: IC2.4(A1) IC2.15(A1) ; port RESET_B
STATUS_B: R1.1 R2.1 ; port STATUS_B
VCC: port VCC, sheet U_Switch/VCC, sheet U_Switch/VCC  [a separate net that carries the same name]
WARN_0: port WARN_0, sheet U_Switch/WARN
WARN_1: port WARN_1, sheet U_Switch/WARN
WARN_VSET: port WARN_VSET, sheet U_Switch/WARN_VSET, sheet U_Switch/WARN_VSET
NetIC2_3: IC2.3(Y0) ; sheet U_Switch/OFF
NetIC2_5: IC2.5(Y1) ; sheet U_Switch/RESET
NetIC2_7: IC2.7(Y2) ; sheet U_Switch/CURR_MEAS_ENA
NetIC2_8: IC2.8(A3) ; sheet U_Switch/STATUS
NetIC2_9: IC2.9(Y3) R1.2
NetIC2_11: IC2.11(A3) ; sheet U_Switch/STATUS
NetIC2_12: IC2.12(Y3) R2.2
NetIC2_14: IC2.14(Y2) ; sheet U_Switch/CURR_MEAS_ENA
NetIC2_16: IC2.16(Y1) ; sheet U_Switch/RESET
NetIC2_18: IC2.18(Y0) ; sheet U_Switch/OFF

### Channels
U_Bank/U_Channel: designators end in _1; ports CH_ENA_0=NetIC1_15 CH_ENA_1=NetIC1_1 CURR_MEAS_ENA_B=NetIC2_1_6 DVDD=DVDD FAULT_VSET=NetR40_1_1 HV=NetC15_2 HV_CURR=NetIC6_23 OFF_B=NetIC2_1_2 RESET_B=NetIC2_1_4 STATUS_B=NetIC6_56 VCC=NetC45_1_1 WARN_0=W_A0 WARN_1=W_B0 WARN_VSET=NetR41_1_1
U_Bank/U_Channel: designators end in _2; ports CH_ENA_0=NetIC1_2 CH_ENA_1=NetIC1_3 CURR_MEAS_ENA_B=NetIC2_1_6 DVDD=DVDD FAULT_VSET=NetR40_1_1 HV=NetC15_2 HV_CURR=NetIC6_23 OFF_B=NetIC2_1_2 RESET_B=NetIC2_1_4 STATUS_B=NetIC6_56 VCC=NetC45_1_1 WARN_0=W_A1 WARN_1=W_B1 WARN_VSET=NetR41_1_1
U_Bank/U_Channel: designators end in _3; ports CH_ENA_0=NetIC1_4 CH_ENA_1=NetIC1_5 CURR_MEAS_ENA_B=NetIC2_1_6 DVDD=DVDD FAULT_VSET=NetR40_1_1 HV=NetC15_2 HV_CURR=NetIC6_23 OFF_B=NetIC2_1_2 RESET_B=NetIC2_1_4 STATUS_B=NetIC6_56 VCC=NetC45_1_1 WARN_0=W_A2 WARN_1=W_B2 WARN_VSET=NetR41_1_1
U_Bank/U_Channel: designators end in _4; ports CH_ENA_0=NetIC1_6 CH_ENA_1=NetIC1_7 CURR_MEAS_ENA_B=NetIC2_1_6 DVDD=DVDD FAULT_VSET=NetR40_1_1 HV=NetC15_2 HV_CURR=NetIC6_23 OFF_B=NetIC2_1_2 RESET_B=NetIC2_1_4 STATUS_B=NetIC6_56 VCC=NetC45_1_1 WARN_0=W_A3 WARN_1=W_B3 WARN_VSET=NetR41_1_1

### Buses and harness runs
harness port SPI = sheet U_TRD/SPI

### Notes on the sheet
- (in symbol R0805_1K_1%_0.33W_100PPM_VISHAY_CRCW-HP) 1%

### Library data of the parts
IC2 = 74HCT244D: as IC4 on sheet MCU; Part Number: 74HCT244D; Component Kind: Standard; Component Type: Standard; Device: 74HCT244D; PackageDescription: SOIC, 1.27mm pitch; 20 pin, 7.50mm W X 12.80mm L X 2.65mm H body, IPC Medium Density; Manufacturer Part Number: 74HCT244D; Pin Count: 20; Case: SOIC20; Mounted: Yes; Socket: No; SMD: Yes; Sense: No; ComponentHeight: 2.65mm; Author: CERN DEM JLC; HelpURL: \\cern.ch\dfs\Applications\Altium\Datasheets\74HCT244D.pdf; CreateDate: 27.08.2013; LatestRevisionDate: 27.08.2013
R1 R2 = R0805_1K_1%_0.33W_100PPM_VISHAY_CRCW-HP: Resistor - 1%; Part Description: 150V, Pulse Proof, High Power Thick Film Chip Resistor; Manufacturer: VISHAY DRALORIC; Manufacturer Part Number: CRCW08051K00FKEAHP; Power: 0.33W; TC: ±100ppm/°C; PressFit: No; Part Number: R0805_1K_1%_0.33W_100PPM_VISHAY_CRCW-HP; Component Kind: Standard; Component Type: Standard; Pin Count: 2; Value: 1k; Status: None; Tolerance: ±1%; Case: 0805; Mounted: Yes; Sense: No; Socket: No; SMD: Yes; Manufacturer1 ComponentHeight: 0.6mm; HelpURL: \\cern.ch\dfs\Applications\Altium\Datasheets\R0805_VISHAY_CRCW-HP e3.pdf; Author: CERN DEM JLC; CreateDate: 16.06.2010; LatestRevisionDate: 16.06.2010

## Sheet Switch.SchDoc
size A4; DocumentNumber: 9; SheetNumber: 9; SheetTotal: 10
Used 8 times, as channels U_Bank/U_Channel/U_Switch, U_Bank/U_Channel/U_Switch, U_Bank/U_Channel/U_Switch, U_Bank/U_Channel/U_Switch, U_Bank/U_Channel/U_Switch, U_Bank/U_Channel/U_Switch, U_Bank/U_Channel/U_Switch, U_Bank/U_Channel/U_Switch. Parts and nets are listed once, with the designators drawn on the sheet.
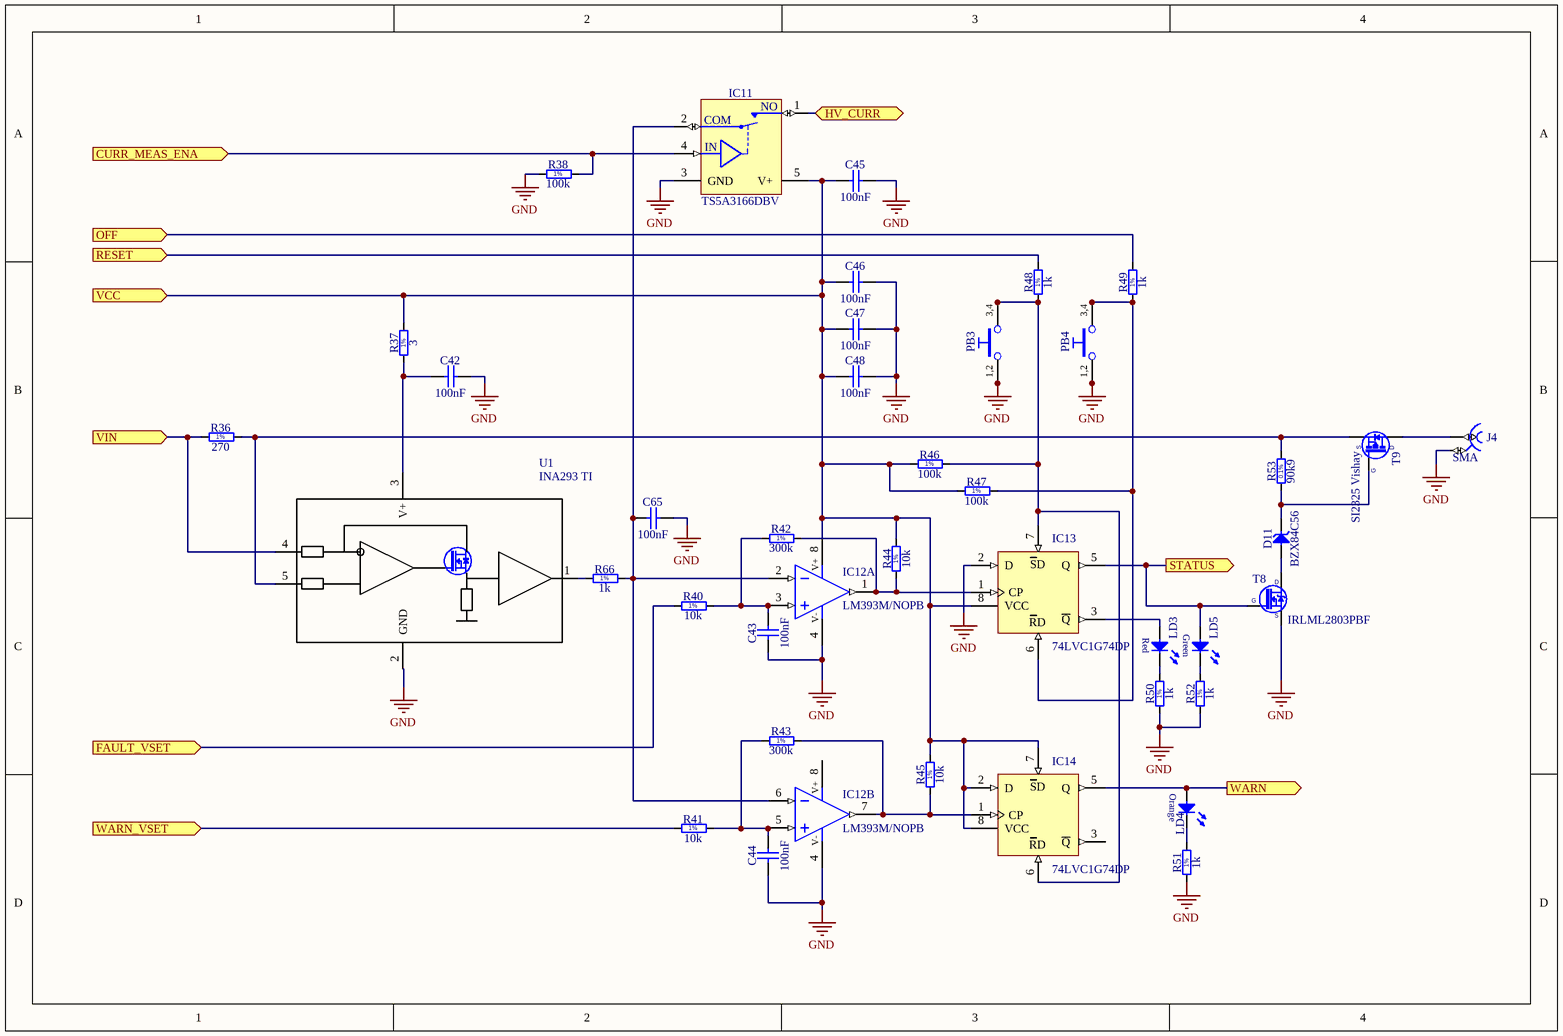
[diagram p6: Switch.SchDoc]

### Parts
C42  100nF  [CAPC2012X135N]
C43  100nF  [CAPC2012X135N]
C44  100nF  [CAPC2012X135N]
C45  100nF  [CAPC2012X135N]
C46  100nF  [CAPC2012X135N]
C47  100nF  [CAPC2012X135N]
C48  100nF  [CAPC2012X135N]
C65  100nF  [CAPC2012X135N]
D11  BZX84C56  [SOT95P248X115-3N]
IC11  TS5A3166DBV  [SOT95P280X145-5N]
IC12  LM393M/NOPB  [SOIC127P600X175-8N]  (parts A,B of 2)
IC13  74LVC1G74DP  [SOP65P400X110-8N]
IC14  74LVC1G74DP  [SOP65P400X110-8N]
J4  SMA  [AMPHENOL_132134]
LD3  Super Red  [LED_OSRAM_LSR976]  (value not drawn)
LD4  Orange  [LED_OSRAM_LOR976]  (value not drawn)
LD5  Green  [LED_OSRAM_LGR971]  (value not drawn)
PB3  Push Button  [PB_OMRON_B3F-1000]  (value not drawn)
PB4  Push Button  [PB_OMRON_B3F-1000]  (value not drawn)
R36  270  [RESC2012X60N]
R37  3  [RESC2012X60N]
R38  100k  [RESC2012X60N]
R40  10k  [RESC2012X60N]
R41  10k  [RESC2012X60N]
R42  300k  [RESC2012X60N]
R43  300k  [RESC2012X60N]
R44  10k  [RESC2012X60N]
R45  10k  [RESC2012X60N]
R46  100k  [RESC2012X60N]
R47  100k  [RESC2012X60N]
R48  1k  [RESC2012X60N]
R49  1k  [RESC2012X60N]
R50  1k  [RESC2012X60N]
R51  1k  [RESC2012X60N]
R52  1k  [RESC2012X60N]
R53  90k9  [RESC2012X60N]
R66  1k  [RESC2012X60N]
T8  IRLML2803PBF  [SOT95P237X112-3N]
T9  SI2325 Vishay  [SOT95P230X112-3N]
U1  INA293 TI  [SOT95P280X110-5N]

### Ports
CURR_MEAS_ENA (in), FAULT_VSET (in), HV_CURR (bidir), OFF (in), RESET (in), STATUS (out), VCC (in), VIN (in), WARN (out), WARN_VSET (in)

### Nets
GND: C42.2 C43.1 C44.1 C45.2 C46.2 C47.2 C48.2 C65.2 IC11.3(GND) IC12.4(V-) IC13.2(D) J4.2 PB3.1 PB3.2 PB4.1 PB4.2 R38.1 R50.1 R51.1 R52.1 T8.2(S) U1.2(GND)
CURR_MEAS_ENA: IC11.4(IN) R38.2 ; port CURR_MEAS_ENA
FAULT_VSET: R40.1 ; port FAULT_VSET
HV_CURR: IC11.1(NO) ; port HV_CURR
OFF: R49.2 ; port OFF
RESET: R48.2 ; port RESET
STATUS: IC13.5(Q) LD5.2(A) T8.1(G) ; port STATUS
VCC: C45.1 C46.1 C47.1 C48.1 IC11.5(V+) IC12.1(OUT) IC12.8(V+) IC13.1(CP) IC13.8(VCC) IC14.2(D) IC14.7(~{S}D) IC14.8(VCC) R37.2 R42.2 R44.1 R44.2 R45.2 R46.1 R47.1 ; port VCC
VIN: R36.1 U1.4(VIN-) ; port VIN
WARN: IC14.5(Q) LD4.2(A) ; port WARN
WARN_VSET: R41.1 ; port WARN_VSET
NetC42_1: C42.1 R37.1 U1.3(V+)
NetC43_2: C43.2 IC12.3(IN+) R40.2 R42.1
NetC44_2: C44.2 IC12.5(IN+) R41.2 R43.1
NetC65_1: C65.1 IC11.2(COM) IC12.2(IN-) IC12.6(IN-) R66.2
NetD11_1: D11.1(A) T8.3(D)
NetD11_3: D11.3(C) R53.1 T9.1(G)
NetIC12_7: IC12.7(OUT) IC14.1(CP) R43.2 R45.1
NetIC13_3: IC13.3(~{Q}) LD3.2(A)
NetIC13_6: IC13.6(~{RD}) PB4.3 PB4.4 R47.2 R49.1
NetIC13_7: IC13.7(~{S}D) IC14.6(~{RD}) PB3.3 PB3.4 R46.2 R48.1
NetJ4_1: J4.1 T9.3(D)
NetLD3_1: LD3.1(C) R50.2
NetLD4_1: LD4.1(C) R51.2
NetLD5_1: LD5.1(C) R52.2
NetR36_2: R36.2 R53.2 T9.2(S) U1.5(VIN+)
NetR66_1: R66.1 U1.1(OUT)

Not connected (* = marked no-connect by the designer): IC13 4(GND); IC14 3(~{Q}) 4(GND)

### Channels
U_Bank/U_Channel/U_Switch: designators end in _1; ports CURR_MEAS_ENA=NetIC2_1_14 FAULT_VSET=NetR40_1_1 HV_CURR=NetIC6_23 OFF=NetIC2_1_18 RESET=NetIC2_1_16 STATUS=NetIC2_1_8 VCC=NetC45_1_1 VIN=NetC15_2 WARN=W_A0 WARN_VSET=NetR41_1_1
U_Bank/U_Channel/U_Switch: designators end in _2; ports CURR_MEAS_ENA=NetIC2_1_7 FAULT_VSET=NetR40_1_1 HV_CURR=NetIC6_23 OFF=NetIC2_1_3 RESET=NetIC2_1_5 STATUS=NetIC2_1_11 VCC=NetC45_1_1 VIN=NetC15_2 WARN=W_B0 WARN_VSET=NetR41_1_1
U_Bank/U_Channel/U_Switch: designators end in _3; ports CURR_MEAS_ENA=NetIC2_2_14 FAULT_VSET=NetR40_1_1 HV_CURR=NetIC6_23 OFF=NetIC2_2_18 RESET=NetIC2_2_16 STATUS=NetIC2_2_8 VCC=NetC45_1_1 VIN=NetC15_2 WARN=W_A1 WARN_VSET=NetR41_1_1
U_Bank/U_Channel/U_Switch: designators end in _4; ports CURR_MEAS_ENA=NetIC2_2_7 FAULT_VSET=NetR40_1_1 HV_CURR=NetIC6_23 OFF=NetIC2_2_3 RESET=NetIC2_2_5 STATUS=NetIC2_2_11 VCC=NetC45_1_1 VIN=NetC15_2 WARN=W_B1 WARN_VSET=NetR41_1_1
U_Bank/U_Channel/U_Switch: designators end in _5; ports CURR_MEAS_ENA=NetIC2_3_14 FAULT_VSET=NetR40_1_1 HV_CURR=NetIC6_23 OFF=NetIC2_3_18 RESET=NetIC2_3_16 STATUS=NetIC2_3_8 VCC=NetC45_1_1 VIN=NetC15_2 WARN=W_A2 WARN_VSET=NetR41_1_1
U_Bank/U_Channel/U_Switch: designators end in _6; ports CURR_MEAS_ENA=NetIC2_3_7 FAULT_VSET=NetR40_1_1 HV_CURR=NetIC6_23 OFF=NetIC2_3_3 RESET=NetIC2_3_5 STATUS=NetIC2_3_11 VCC=NetC45_1_1 VIN=NetC15_2 WARN=W_B2 WARN_VSET=NetR41_1_1
U_Bank/U_Channel/U_Switch: designators end in _7; ports CURR_MEAS_ENA=NetIC2_4_14 FAULT_VSET=NetR40_1_1 HV_CURR=NetIC6_23 OFF=NetIC2_4_18 RESET=NetIC2_4_16 STATUS=NetIC2_4_8 VCC=NetC45_1_1 VIN=NetC15_2 WARN=W_A3 WARN_VSET=NetR41_1_1
U_Bank/U_Channel/U_Switch: designators end in _8; ports CURR_MEAS_ENA=NetIC2_4_7 FAULT_VSET=NetR40_1_1 HV_CURR=NetIC6_23 OFF=NetIC2_4_3 RESET=NetIC2_4_5 STATUS=NetIC2_4_11 VCC=NetC45_1_1 VIN=NetC15_2 WARN=W_B3 WARN_VSET=NetR41_1_1

### Notes on the sheet
- (in symbol 74LVC1G74DP) SD; RD
- (in symbol LED_OSRAM_LSR976) Red
- (in symbol PB_OMRON_B3F-1000) 3,4; 1,2
- (in symbol R0805_1K_1%_0.33W_100PPM_VISHAY_CRCW-HP) 1%
- (in symbol R0805_3R_1%_0.125W_200PPM) 1%
- (in symbol R0805_10K_1%_0.125W_100PPM) 1%
- (in symbol R0805_90K9_0.1%_0.1W_10PPM) 0.1%
- (in symbol R0805_100K_1%_0.125W_100PPM) 1%
- (in symbol R0805_270R_1%_0.125W_100PPM) 1%
- (in symbol R0805_300K_1%_0.125W_100PPM) 1%

### Library data of the parts
C42-C48 C65 = CC0805_100NF_50V_10%_X7R: as C35 on sheet Pulser; Part Number: CC0805_100NF_50V_10%_X7R; Component Kind: Standard; Component Type: Standard; Pin Count: 2; Value: 100nF; Status: Preferred; Manufacturer Part Number: CC0805_100NF_50V_10%_X7R; Case: 0805; Mounted: Yes; Socket: No; SMD: Yes; Sense: No; Manufacturer1 Example: TDK; Manufacturer1 ComponentHeight: 1mm; HelpURL: \\cern.ch\dfs\Applications\Altium\Datasheets\CC0805_X7R_TDK_C.pdf; Author: CERN DEM JLC; CreateDate: 03.12.2007; LatestRevisionDate: 22.04.2015
D11 = BZX84C56: Diode Zener Anode Pin 1 Cathode Pin 3 (Pas de pin 2); Part Description: Small Signal Zener Diode; Manufacturer: VISHAY SEMICONDUCTOR; Voltage: 56V; Power: 300mW; PressFit: No; Bonding: No; Part Number: BZX84C56; Component Kind: Standard; Component Type: Standard; Device: BZX84C56; PackageDescription: SOT, 0.95mm Pitch; 3 Pin, 1.315mm W X 2.95mm L X 1.15mm H body, IPC Medium Density; Manufacturer Part Number: BZX84C56; Pin Count: 2; Case: SOT23-3; Mounted: Yes; Socket: No; SMD: Yes; Sense: No; ComponentHeight: 1.15mm; HelpURL: \\cern.ch\dfs\Applications\Altium\Datasheets\BZX84C56.pdf; Author: CERN DEM JLC; CreateDate: 19.06.2017; LatestRevisionDate: 19.06.2017
IC11 = TS5A3166DBV: 0.9-Ω SPST Analog Switch; Manufacturer: TEXAS INSTRUMENTS; PressFit: No; Bonding: No; Part Number: TS5A3166DBV; Component Kind: Standard; Component Type: Standard; Device: TS5A3166DBV; PackageDescription: SOT, 0.95mm pitch; 5 pin, 1.60mm W X 2.90mm L X 1.45mm H body, IPC Medium Density; Part Description: 0.9-Ω SPST Analog Switch; Manufacturer Part Number: TS5A3166DBV; Pin Count: 5; Case: SOT23-5; Mounted: Yes; Socket: No; SMD: Yes; Sense: No; ComponentHeight: 1.45mm; Author: CERN DEM MR; HelpURL: \\cern.ch\dfs\Applications\Altium\Datasheets\TS5A3166DBV.pdf; CreateDate: 16.06.2016; LatestRevisionDate: 16.06.2016
IC12 = LM393M/NOPB: Dual Operational Amplifier; Part Description: Low Power Low Offset Voltage Dual Comparators; Manufacturer: NATIONAL SEMICONDUCTOR; PressFit: No; Bonding: No; Part Number: LM393M/NOPB; Component Kind: Standard; Component Type: Standard; Device: LM393M/NOPB; PackageDescription: SOIC 8, Pitch 1.27mm - Body 4x5mm, IPC Medium Density; Manufacturer Part Number: LM393M/NOPB; Pin Count: 8; Case: SOIC8; Mounted: Yes; Socket: No; SMD: Yes; Sense: No; ComponentHeight: 1.75mm; Author: CERN DEM JLC; HelpURL: \\cern.ch\dfs\Applications\Altium\Datasheets\LM393M-NOPB.pdf; CreateDate: 18.11.2011; LatestRevisionDate: 18.11.2011
IC13 IC14 = 74LVC1G74DP: Single D-type flip-flop with set and reset, positive edge trigger; Manufacturer: NXP SEMICONDUCTORS; PressFit: No; Bonding: No; Part Number: 74LVC1G74DP; Component Kind: Standard; Component Type: Standard; Device: 74LVC1G74DP; PackageDescription: SOP, 0.65mm, pitch; 8 pin, 3.00mm W X 3.00mm L X 1.10mm H body, PC Medium Density; Part Description: Single D-Type Flip-Flop With Set And Reset, Positive Edge Trigger; Manufacturer Part Number: 74LVC1G74DP; Pin Count: 8; Case: TSSOP8; Mounted: Yes; Socket: No; SMD: Yes; Sense: No; ComponentHeight: 1.1mm; Author: CERN DEM JLC; HelpURL: \\cern.ch\dfs\Applications\Altium\Datasheets\74LVC1G74DP.pdf; CreateDate: 26.04.2010; LatestRevisionDate: 26.04.2010
J4 = AMPHENOL_132134: Part Description: 50 Ohm Through Hole SMA Straight PCB Jack; Manufacturer Part Number: 132134; PressFit: No; Part Number: AMPHENOL_132134; Component Kind: Standard; Component Type: Standard; Pin Count: 4; Family: SMA; Mounted: Yes; Socket: No; SMD: No; Sense: No; Status: None; Manufacturer: AMPHENOL; ComponentHeight: 9.53mm; HelpURL: \\cern.ch\dfs\Applications\Altium\Datasheets\AMPHENOL_132134.pdf; Author: CERN DEM JLC; CreateDate: 16.12.2013; LatestRevisionDate: 16.12.2013
LD3 = LED_OSRAM_LSR976: LED Red 1C 2A; Part Description: Surface Mount Super Red LED (0805 Case); Manufacturer: OSRAM; Manufacturer Part Number: LSR976; PressFit: No; Bonding: No; Part Number: LED_OSRAM_LSR976; Component Kind: Standard; Component Type: Standard; Color: Super Red; PackageDescription: Super Red Chip LED, 2-Leads, Body 2 x1.25mm, IPC Medium Density; Pin Count: 2; Case: 0805; Mounted: Yes; Socket: No; SMD: Yes; Sense: No; ComponentHeight: 0.9mm; HelpURL: \\cern.ch\dfs\Applications\Altium\Datasheets\LED_OSRAM_LSR976.pdf; Author: CERN DEM JLC; CreateDate: 18.05.2010; LatestRevisionDate: 18.05.2010
LD4 = LED_OSRAM_LOR976: LED Orange 1C 2A; Part Description: Surface Mount Orange LED (0805 Case); Manufacturer: OSRAM; Manufacturer Part Number: LOR976; PressFit: No; Bonding: No; Part Number: LED_OSRAM_LOR976; Component Kind: Standard; Component Type: Standard; Color: Orange; PackageDescription: Orange Chip LED, 2-Leads, Body 2 x1.25mm, IPC Medium Density; Pin Count: 2; Case: 0805; Mounted: Yes; Socket: No; SMD: Yes; Sense: No; ComponentHeight: 0.9mm; HelpURL: \\cern.ch\dfs\Applications\Altium\Datasheets\LED_OSRAM_LOR976.pdf; Author: CERN DEM JLC; CreateDate: 18.05.2010; LatestRevisionDate: 18.05.2010
LD5 = LED_OSRAM_LGR971: LED Green 1C 2A; Part Description: Surface Mount Green LED (0805 Case); Manufacturer: OSRAM; Manufacturer Part Number: LGR971; PressFit: No; Bonding: No; Part Number: LED_OSRAM_LGR971; Component Kind: Standard; Component Type: Standard; Color: Green; PackageDescription: Green Chip LED, 2-Leads, Body 2.0x1.25mm, IPC Medium Density; Pin Count: 2; Case: 0805; Mounted: Yes; Socket: No; SMD: Yes; Sense: No; ComponentHeight: 0.9mm; HelpURL: \\cern.ch\dfs\Applications\Altium\Datasheets\LED_OSRAM_LGR971.pdf; Author: CERN DEM JLC; CreateDate: 28.01.2009; LatestRevisionDate: 17.03.2010
PB3 PB4 = PB_OMRON_B3F-1000: as PB1 on sheet MCU; Part Number: PB_OMRON_B3F-1000; Component Kind: Standard; Component Type: Standard; Pin Count: 4; PackageDescription: 6x6mm Model, Horizontal, Flat Plunger Type (without Ground Terminal) Pushbutton Switch, OMRON B3F Series; Family: Push Button; Mounted: Yes; Socket: No; SMD: No; Sense: No; Status: None; Manufacturer Part Number: B3F-1000; ComponentHeight: 4.5mm; HelpURL: \\cern.ch\dfs\Applications\Altium\Datasheets\PB_OMRON_B3F-1000.pdf; Author: CERN DEM JMW; CreateDate: 23.10.2008; LatestRevisionDate: 06.05.2009
R36 = R0805_270R_1%_0.125W_100PPM: Resistor - 1%; Part Description: General Purpose Thick Film Chip Resistor; Manufacturer: GENERIC; Manufacturer1 Part Number: NRC10F2700TRF; Power: 0.125W; TC: ±100ppm/°C; PressFit: No; Part Number: R0805_270R_1%_0.125W_100PPM; Component Kind: Standard; Component Type: Standard; Pin Count: 2; Value: 270; Status: Preferred; Tolerance: ±1%; Manufacturer Part Number: R0805_270R_1%_0.125W_100PPM; Case: 0805; Mounted: Yes; Sense: No; Socket: No; SMD: Yes; Manufacturer1 Example: NIC COMPONENT; Manufacturer1 ComponentHeight: 0.6mm; HelpURL: \\cern.ch\dfs\Applications\Altium\Datasheets\R0805_NIC_NRC.pdf; Author: CERN DEM JLC; CreateDate: 03.12.2007; LatestRevisionDate: 13.03.2008
R37 = R0805_3R_1%_0.125W_200PPM: Resistor - 1%; Part Description: General Purpose Thick Film Chip Resistor; Manufacturer: GENERIC; Manufacturer1 Part Number: 232273463008L or RC0805FR-073RL; Power: 0.125W; TC: ±200ppm/°C; PressFit: No; Part Number: R0805_3R_1%_0.125W_200PPM; Component Kind: Standard; Component Type: Standard; Pin Count: 2; Value: 3; Status: Preferred; Tolerance: ±1%; Manufacturer Part Number: R0805_3R_1%_0.125W_200PPM; Case: 0805; Mounted: Yes; Sense: No; Socket: No; SMD: Yes; Manufacturer1 Example: YAGEO PHYCOMP; Manufacturer1 ComponentHeight: 0.65mm; HelpURL: \\cern.ch\dfs\Applications\Altium\Datasheets\R0805_Phycomp_RC0805.pdf; Author: CERN DEM JLC; CreateDate: 03.12.2007; LatestRevisionDate: 17.10.2012
R38 R46 R47 = R0805_100K_1%_0.125W_100PPM: Resistor - 1%; Part Description: General Purpose Thick Film Chip Resistor; Manufacturer: GENERIC; Manufacturer1 Part Number: NRC10F1003TRF; Power: 0.125W; TC: ±100ppm/°C; PressFit: No; Part Number: R0805_100K_1%_0.125W_100PPM; Component Kind: Standard; Component Type: Standard; Pin Count: 2; Value: 100k; Status: Preferred; Tolerance: ±1%; Manufacturer Part Number: R0805_100K_1%_0.125W_100PPM; Case: 0805; Mounted: Yes; Sense: No; Socket: No; SMD: Yes; Manufacturer1 Example: NIC COMPONENT; Manufacturer1 ComponentHeight: 0.6mm; HelpURL: \\cern.ch\dfs\Applications\Altium\Datasheets\R0805_NIC_NRC.pdf; Author: CERN DEM JLC; CreateDate: 03.12.2007; LatestRevisionDate: 13.03.2008
R40 R41 R44 R45 = R0805_10K_1%_0.125W_100PPM: as R27 on sheet MCU; Part Number: R0805_10K_1%_0.125W_100PPM; Component Kind: Standard; Component Type: Standard; Pin Count: 2; Value: 10k; Status: Preferred; Tolerance: ±1%; Manufacturer Part Number: R0805_10K_1%_0.125W_100PPM; Case: 0805; Mounted: Yes; Sense: No; Socket: No; SMD: Yes; Manufacturer1 Example: NIC COMPONENT; Manufacturer1 ComponentHeight: 0.6mm; HelpURL: \\cern.ch\dfs\Applications\Altium\Datasheets\R0805_NIC_NRC.pdf; Author: CERN DEM JLC; CreateDate: 03.12.2007; LatestRevisionDate: 13.03.2008
R42 R43 = R0805_300K_1%_0.125W_100PPM: Resistor - 1%; Part Description: General Purpose Thick Film Chip Resistor; Manufacturer: GENERIC; Manufacturer1 Part Number: NRC10F3003TRF; Power: 0.125W; TC: ±100ppm/°C; PressFit: No; Part Number: R0805_300K_1%_0.125W_100PPM; Component Kind: Standard; Component Type: Standard; Pin Count: 2; Value: 300k; Status: Preferred; Tolerance: ±1%; Manufacturer Part Number: R0805_300K_1%_0.125W_100PPM; Case: 0805; Mounted: Yes; Sense: No; Socket: No; SMD: Yes; Manufacturer1 Example: NIC COMPONENT; Manufacturer1 ComponentHeight: 0.6mm; HelpURL: \\cern.ch\dfs\Applications\Altium\Datasheets\R0805_NIC_NRC.pdf; Author: CERN DEM JLC; CreateDate: 03.12.2007; LatestRevisionDate: 13.03.2008
R48-R52 R66 = R0805_1K_1%_0.33W_100PPM_VISHAY_CRCW-HP: as R1 on sheet Channel; Part Number: R0805_1K_1%_0.33W_100PPM_VISHAY_CRCW-HP; Component Kind: Standard; Component Type: Standard; Pin Count: 2; Value: 1k; Status: None; Tolerance: ±1%; Case: 0805; Mounted: Yes; Sense: No; Socket: No; SMD: Yes; Manufacturer1 ComponentHeight: 0.6mm; HelpURL: \\cern.ch\dfs\Applications\Altium\Datasheets\R0805_VISHAY_CRCW-HP e3.pdf; Author: CERN DEM JLC; CreateDate: 16.06.2010; LatestRevisionDate: 16.06.2010
R53 = R0805_90K9_0.1%_0.1W_10PPM: Resistor - 0.1%; Part Description: Thin Film Chip Resistor; Manufacturer: GENERIC; Manufacturer1 Part Number: RN73C2A90K9BTG; Power: 0.1W; TC: ±10ppm; PressFit: No; Part Number: R0805_90K9_0.1%_0.1W_10PPM; Component Kind: Standard; Component Type: Standard; Pin Count: 2; Value: 90k9; Status: Not Recommended; Tolerance: ±0.1%; Manufacturer Part Number: R0805_90K9_0.1%_0.1W_10PPM; Case: 0805; Mounted: Yes; Sense: No; Socket: No; SMD: Yes; Manufacturer1 Example: TYCO HOLSWORTHY; Manufacturer1 ComponentHeight: 0.6mm; HelpURL: \\cern.ch\dfs\Applications\Altium\Datasheets\R0805_Tyco_RN73.pdf; Author: CERN DEM JLC; CreateDate: 03.12.2007; LatestRevisionDate: 13.03.2008
T8 = IRLML2803PBF: N-CHANNEL MOSFET WITH ZENER DIODE; Part Description: 30V 1.2A  N-Channel HEXFET® Power MOSFET; Manufacturer: INTERNATIONAL RECTIFIER; PressFit: No; Bonding: No; Part Number: IRLML2803PBF; Component Kind: Standard; Component Type: Standard; Device: IRLML2803PBF; PackageDescription: SOT, 0.95mm, pitch; 3 pin,1.30mm W X 2.92mm L X 1.12mm H body, IPC Medium Density; Manufacturer Part Number: IRLML2803PBF; Pin Count: 3; Case: SOT23-3; Mounted: Yes; Socket: No; SMD: Yes; Sense: No; ComponentHeight: 1.12mm; HelpURL: \\cern.ch\dfs\Applications\Altium\Datasheets\IRLML2803PBF.pdf; Author: CERN DEM JMW; CreateDate: 08.12.2010; LatestRevisionDate: 08.12.2010
T9 = SI2325: P-Channel MOSFET; Name: SI2325; Manufacturer: Vishay
U1 = INA293: Name: INA293; Manufacturer: TI

## Sheet TRD.SchDoc
size A4; DocumentNumber: 10; SheetNumber: 10; SheetTotal: 10
Used 8 times, as channels U_Bank/U_Channel/U_TRD, U_Bank/U_Channel/U_TRD, U_Bank/U_Channel/U_TRD, U_Bank/U_Channel/U_TRD, U_Bank/U_Channel/U_TRD, U_Bank/U_Channel/U_TRD, U_Bank/U_Channel/U_TRD, U_Bank/U_Channel/U_TRD. Parts and nets are listed once, with the designators drawn on the sheet.
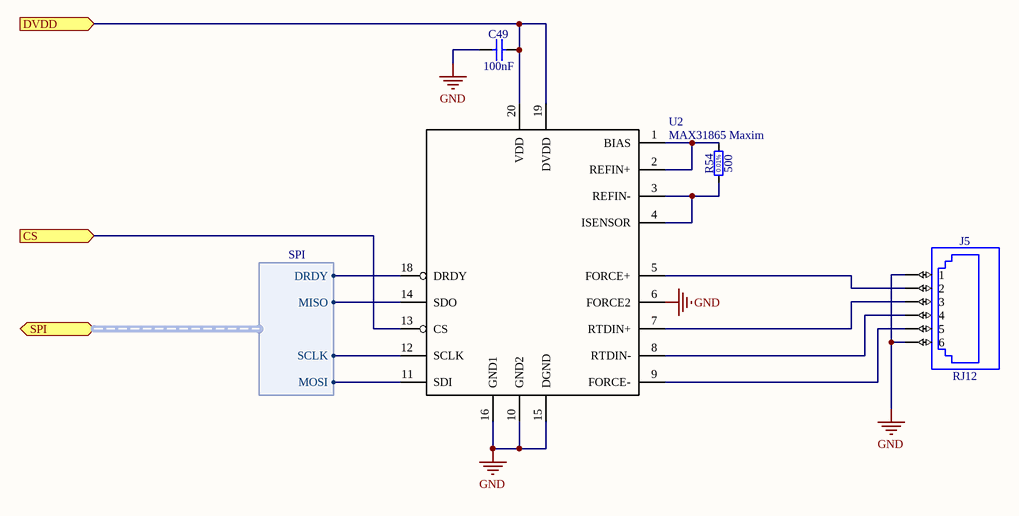
[diagram p7: TRD.SchDoc]

### Parts
C49  100nF  [CAPC2012X135N]
J5  RJ12  [WURTH_615006138521]
R54  500  [RESC2013X64N]
U2  MAX31865 Maxim  [QFN65P500X500X80-21N-S335]

### Ports
CS (in), DVDD (in), SPI (bidir, harness SPI)

### Harnesses
SPI: DRDY, MISO, SCLK, MOSI

### Nets
GND: C49.1 J5.1 J5.6 U2.6(FORCE2) U2.10(GND2) U2.15(DGND) U2.16(GND1)
CS: U2.13(CS) ; port CS
DVDD: C49.2 U2.19(DVDD) U2.20(VDD) ; port DVDD
NetJ5_2: J5.2 U2.5(FORCE+)
NetJ5_3: J5.3 U2.7(RTDIN+)
NetJ5_4: J5.4 U2.8(RTDIN-)
NetJ5_5: J5.5 U2.9(FORCE-)
NetR54_1: R54.1 U2.3(REFIN-) U2.4(ISENSOR)
NetR54_2: R54.2 U2.1(BIAS) U2.2(REFIN+)
NetU2_11: U2.11(SDI) ; port SPI.MOSI
NetU2_12: U2.12(SCLK) ; port SPI.SCLK
NetU2_14: U2.14(SDO) ; port SPI.MISO
NetU2_18: U2.18(DRDY) ; port SPI.DRDY

Not connected (* = marked no-connect by the designer): U2 17

### Channels
U_Bank/U_Channel/U_TRD: designators end in _1; ports CS=NetIC1_1 DVDD=DVDD
U_Bank/U_Channel/U_TRD: designators end in _2; ports CS=NetIC1_15 DVDD=DVDD
U_Bank/U_Channel/U_TRD: designators end in _3; ports CS=NetIC1_3 DVDD=DVDD
U_Bank/U_Channel/U_TRD: designators end in _4; ports CS=NetIC1_2 DVDD=DVDD
U_Bank/U_Channel/U_TRD: designators end in _5; ports CS=NetIC1_5 DVDD=DVDD
U_Bank/U_Channel/U_TRD: designators end in _6; ports CS=NetIC1_4 DVDD=DVDD
U_Bank/U_Channel/U_TRD: designators end in _7; ports CS=NetIC1_7 DVDD=DVDD
U_Bank/U_Channel/U_TRD: designators end in _8; ports CS=NetIC1_6 DVDD=DVDD

### Notes on the sheet
- (in symbol R0805_500R_0.01%_0.2W_0.2PPM_VISHAY_VSMP) 0.01%

### Library data of the parts
C49 = CC0805_100NF_50V_10%_X7R: as C35 on sheet Pulser; Part Number: CC0805_100NF_50V_10%_X7R; Component Kind: Standard; Component Type: Standard; Pin Count: 2; Value: 100nF; Status: Preferred; Manufacturer Part Number: CC0805_100NF_50V_10%_X7R; Case: 0805; Mounted: Yes; Socket: No; SMD: Yes; Sense: No; Manufacturer1 Example: TDK; Manufacturer1 ComponentHeight: 1mm; HelpURL: \\cern.ch\dfs\Applications\Altium\Datasheets\CC0805_X7R_TDK_C.pdf; Author: CERN DEM JLC; CreateDate: 03.12.2007; LatestRevisionDate: 22.04.2015
J5 = WURTH_615006138521: Connector RJ12 (6P6C); Part Description: 1 Port RJ12 Connector, 6P6C,  Straight With Ears; Manufacturer: WURTH ELEKTRONIK; PressFit: No; Part Number: WURTH_615006138521; Component Kind: Standard; Component Type: Standard; Pin Count: 6; Family: RJ12; Mounted: Yes; Socket: No; SMD: No; Sense: No; Status: None; Manufacturer Part Number: 615006138521; ComponentHeight: 16.15mm; HelpURL: \\cern.ch\dfs\Applications\Altium\Datasheets\WURTH_615006138521.pdf; Author: CERN DEM MR; CreateDate: 15.03.2016; LatestRevisionDate: 15.03.2016
R54 = R0805_500R_0.01%_0.2W_0.2PPM_VISHAY_VSMP: Resistor - 0.01%; Part Description: Ultra High Precision Foil Wraparound Surface Mount Chip Resistor; Manufacturer: VISHAY PRECISION; Manufacturer Part Number: Y1624500R000T9R; Power: 0.2W; TC: ±0.2ppm/°C; PressFit: No; Part Number: R0805_500R_0.01%_0.2W_0.2PPM_VISHAY_VSMP; Component Kind: Standard; Component Type: Standard; Pin Count: 2; Value: 500; Status: None; Tolerance: ±0.01%; Case: 0805; Mounted: Yes; Sense: No; Socket: No; SMD: Yes; Manufacturer1 ComponentHeight: 0.64mm; HelpURL: \\cern.ch\dfs\Applications\Altium\Datasheets\R0805_VISHAY_VSMP.pdf; Author: CERN DEM JLC; CreateDate: 22.09.2011; LatestRevisionDate: 22.09.2011
U2 = MAX31865: Name: MAX31865; Manufacturer: Maxim

## Sheet DAC.SchDoc
size A4; DocumentNumber: 8; SheetNumber: 8; SheetTotal: 10
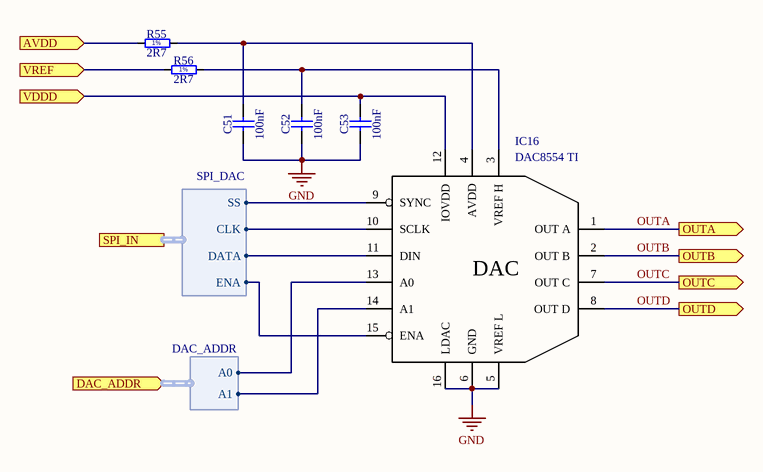
[diagram p8: DAC.SchDoc]

### Parts
C51  100nF  [CAPC2012X135N]
C52  100nF  [CAPC2012X135N]
C53  100nF  [CAPC2012X135N]
IC16  DAC8554 TI  [TSOP65P640X120-16N]
R55  2R7  [RESC2012X60N]
R56  2R7  [RESC2012X60N]

### Ports
AVDD (in), DAC_ADDR (in, harness DAC_ADDR), OUTA (out), OUTB (out), OUTC (out), OUTD (out), SPI_IN (harness SPI_DAC), VDDD (in), VREF (in)

### Harnesses
SPI_DAC: DATA, CLK, SS, ENA
DAC_ADDR: A0, A1

### Nets
DVDD: C53.2 IC16.12(IOVDD) IC16.15(ENA) ; port VDDD, port SPI_IN.ENA
GND: C51.1 C52.1 C53.1 IC16.5(VREF_L) IC16.6(GND) IC16.13(A0) IC16.14(A1) IC16.16(LDAC) ; port DAC_ADDR.A0, port DAC_ADDR.A1
OUTA: IC16.1(OUT_A) ; port OUTA
OUTB: IC16.2(OUT_B) ; port OUTB
OUTC: IC16.7(OUT_C) ; port OUTC
OUTD: IC16.8(OUT_D) ; port OUTD
NetC45_1_1: R55.1 ; port AVDD
NetC51_2: C51.2 IC16.4(AVDD) R55.2
NetC52_2: C52.2 IC16.3(VREF_H) R56.2
NetIC6_20: IC16.9(SYNC) ; port SPI_IN.SS
NetIC6_21: IC16.10(SCLK) ; port SPI_IN.CLK
NetIC6_22: IC16.11(DIN) ; port SPI_IN.DATA
NetL7_2: R56.1 ; port VREF

### Notes on the sheet
- (in symbol DAC8554) DAC
- (in symbol R0805_2R7_1%_0.125W_200PPM) 1%

### Library data of the parts
C51-C53 = CC0805_100NF_50V_10%_X7R: Non-polarised capacitor; Part Description: SMD Multilayer Chip Ceramic Capacitor; Manufacturer: GENERIC; Manufacturer1 Part Number: C2012X7R1H104K085AA; Voltage: 50V; TC: X7R; Tolerance: ±10%; Part Number: CC0805_100NF_50V_10%_X7R; Component Kind: Standard; Component Type: Standard; Pin Count: 2; Value: 100nF; Status: Preferred; Manufacturer Part Number: CC0805_100NF_50V_10%_X7R; Case: 0805; Mounted: Yes; Socket: No; SMD: Yes; Sense: No; Manufacturer1 Example: TDK; Manufacturer1 ComponentHeight: 1mm; HelpURL: \\cern.ch\dfs\Applications\Altium\Datasheets\CC0805_X7R_TDK_C.pdf; Author: CERN DEM JLC; CreateDate: 03.12.2007; LatestRevisionDate: 22.04.2015
IC16 = DAC8554: Name: DAC8554; Manufacturer: TI
R55 R56 = R0805_2R7_1%_0.125W_200PPM: Resistor - 1%; Part Description: General Purpose Thick Film Chip Resistor; Manufacturer: GENERIC; Manufacturer1 Part Number: 232273462708L or RC0805FR-072R7L; Power: 0.125W; TC: ±200ppm/°C; PressFit: No; Part Number: R0805_2R7_1%_0.125W_200PPM; Component Kind: Standard; Component Type: Standard; Pin Count: 2; Value: 2R7; Status: Preferred; Tolerance: ±1%; Manufacturer Part Number: R0805_2R7_1%_0.125W_200PPM; Case: 0805; Mounted: Yes; Sense: No; Socket: No; SMD: Yes; Manufacturer1 Example: YAGEO PHYCOMP; Manufacturer1 ComponentHeight: 0.65mm; HelpURL: \\cern.ch\dfs\Applications\Altium\Datasheets\R0805_Phycomp_RC0805.pdf; Author: CERN DEM JLC; CreateDate: 03.12.2007; LatestRevisionDate: 17.10.2012